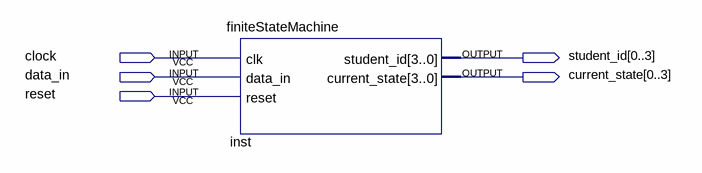
[diagram p0: schematic sheet]
// Quartus schematic fsmBDF.bdf as structural Verilog: 1 symbols, 5 pins
module fsmBDF (
  input  clock,
  input  data_in,
  input  reset,
  output [0:3] student_id,
  output [0:3] current_state
);

  finiteStateMachine inst (
    .clk(clock), .data_in(data_in), .reset(reset), .student_id(student_id), .current_state(current_state));
endmodule
